# EAGLE design ESP32C-Mini-MQL-Injection-V2 (EAGLE 7.7.0)
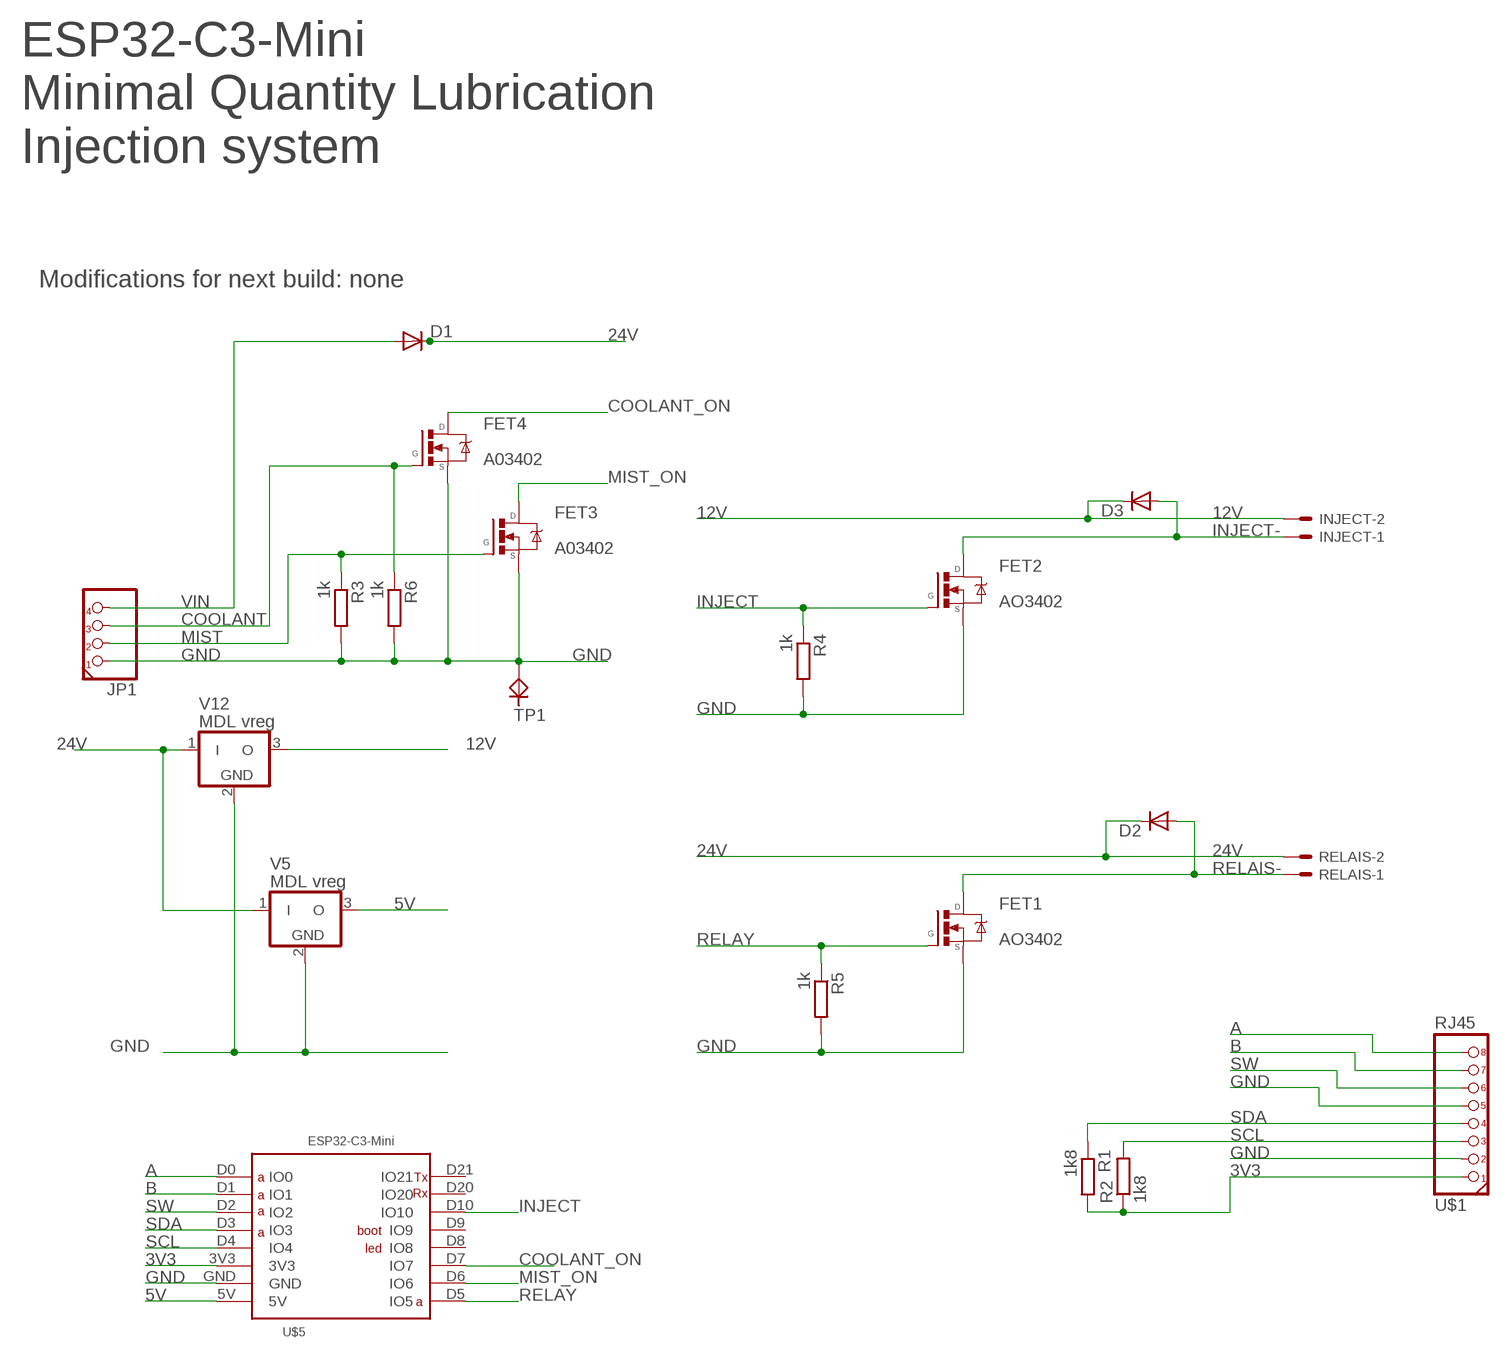
[diagram p0: schematic, sheet 1]

## Parts
D1  DIODE-DO214ACI  [DO214ACI]
D2  DIODE-DO214ACI  [DO214ACI]
D3  DIODE-DO214ACI  [DO214ACI]
FET1  AO3402  NFETHEX-S  [SOT23-FET]
FET2  AO3402  NFETHEX-S  [SOT23-FET]
FET3  A03402  NFETHEX-S  [SOT23-FET]
FET4  A03402  NFETHEX-S  [SOT23-FET]
INJECT  JST-XH-02-PIN-L  [JST-XH-02-L]
JP1  PINHD-1X4PH254  [1X04/PH254]
R1  1k8  R-EU_R0805  [R0805]
R2  1k8  R-EU_R0805  [R0805]
R3  1k  R-EU_R0805  [R0805]
R4  1k  R-EU_R0805  [R0805]
R5  1k  R-EU_R0805  [R0805]
R6  1k  R-EU_R0805  [R0805]
RELAIS  JST-XH-02-PIN-L  [JST-XH-02-L]
TP1  TESTPIN-TP10  [TP10]
U$1  RJ45  [RJ45]
U$5  ESP32C3MINIL  [ESP32-C3-MINI]
V5  MDL vreg  VREGMDLSTDWNV  [MDLSTEPDOWNV02]
V12  MDL vreg  VREGMDLSTDWNV  [MDLSTEPDOWNV02]

## Nets
3V3: R1.2 R2.1 U$1.P$1 U$5.3V3
5V: U$5.5V V5.3(O)
12V: D3.C INJECT.2 V12.3(O)
24V: D1.C D2.C RELAIS.2 V5.1(I) V12.1(I)
A: U$1.P$8 U$5.D0(IO0)
B: U$1.P$7 U$5.D1(IO1)
COOLANT: FET4.G JP1.3 R6.1
COOLANT_ON: FET4.D U$5.D7(IO7)
GND: FET1.S FET2.S FET3.S FET4.S JP1.1 R3.2 R4.2 R5.2 R6.2 TP1.TP U$1.P$2 U$1.P$5 U$5.GND V5.2(GND) V12.2(GND)
INJECT: FET2.G R4.1 U$5.D10(IO10)
INJECT-: D3.A FET2.D INJECT.1
MIST: FET3.G JP1.2 R3.1
MIST_ON: FET3.D U$5.D6(IO6)
RELAIS-: D2.A FET1.D RELAIS.1
RELAY: FET1.G R5.1 U$5.D5(IO5)
SCL: R2.2 U$1.P$3 U$5.D4(IO4)
SDA: R1.1 U$1.P$4 U$5.D3(IO3)
SW: U$1.P$6 U$5.D2(IO2)
VIN: D1.A JP1.4
Unconnected: U$5.D8(IO8) U$5.D9(IO9) U$5.D20(IO20) U$5.D21(IO21)

## Notes on the sheet
- ESP32-C3-Mini
  Minimal Quantity Lubrication
  Injection system
- Modifications for next build: none

## Library data of the parts
D1-D3 = MyLib:DIODE: DIODE Diode
FET1-FET4 = MyLib:NFETHEX
INJECT RELAIS = JST-XH-Pins-Swapped:JST-XH-02-PIN: JST XH Connector 2 Pin Wire to board connector. Pitch: 2,54 mm, (0.100") Number of pins: 2 Created by Rembrandt Electronics www.rembrandtelectronics.com
JP1 = MyLib:PINHD-1X4: PIN HEADER
R1-R6 = rcl:R-EU_: RESISTOR, European symbol
TP1 = MyLib:TESTPIN
U$1 = MyLib:RJ45
U$5 = ESP32:ESP32C3MINI
V5 V12 = MyLib:VREG: 3 terminal voltage regulator PIN-1 input PIN-2 GND PIN-3 Output 78XX,79XX,LP2950

## Net classes
0 default: width 0.254 mm, clearance 0.254 mm
3 usbvcc: width 0.508 mm, drill 0.61 mm, clearance 0.254 mm

## Board
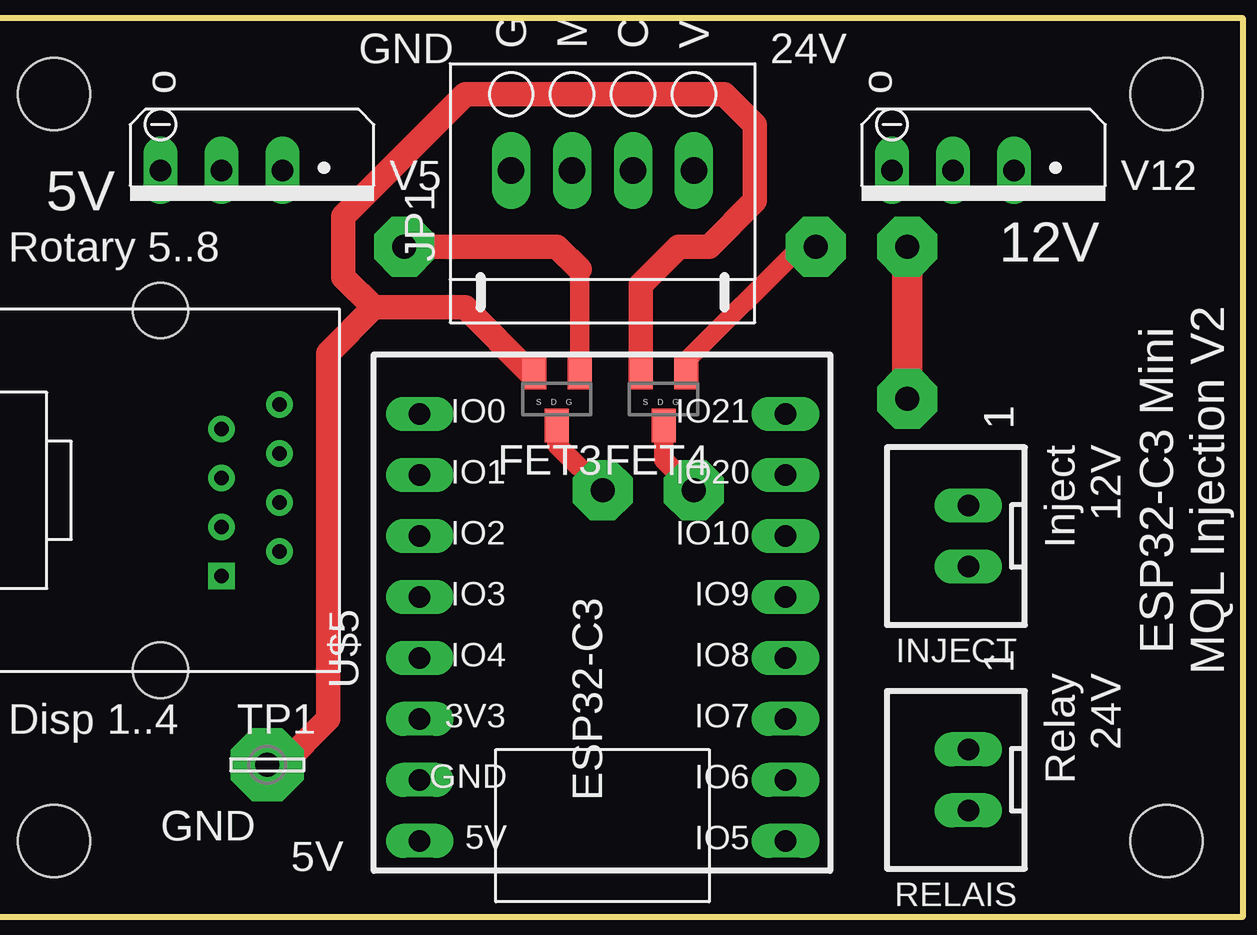
[diagram p1: board, top side]
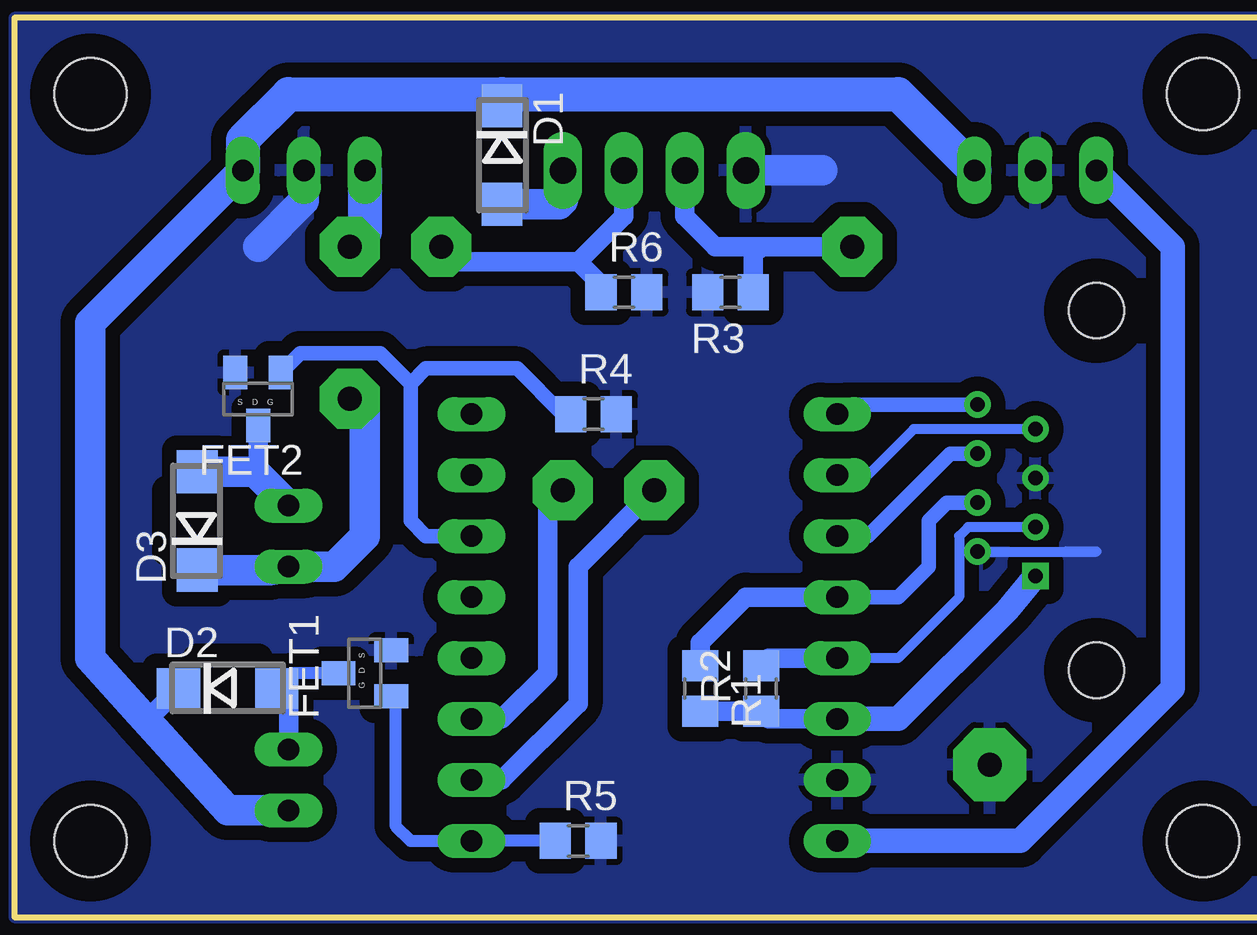
[diagram p2: board, bottom side, seen from below]

No outline drawn. Coordinates in mm, seen from the top.
Copper layers (1*16): Top 0.035mm / dielectric 1.5mm / Bottom 0.035mm
Design rules "default *": minimum track width 10mil, minimum drill 0.6mm, track to track 0.2mm, track to pad 0.2mm, pad to pad 0.2mm, via to via 0.2mm, smd to smd 0.2mm, copper to edge 40mil, drill to drill 8mil, minimum pad ring 10mil, minimum via ring 8mil, stop-mask expansion 4mil, vias tented up to drill 0mil, thermal gap 10mil
Holes 3 mm at 49.53,34.29 49.53,3.17 3.17,34.29 3.17,3.17
Milling: 4 lines

### Footprints (pad centres in the part's own frame; a part is rotated, then mirrored left to right if it is on the bottom)
DO214ACI = smd 1.8 x 1.7: A 2.05,0; C -2.05,0
SOT23-FET = smd 1 x 1.4: D 0,1.1; G -0.95,-1.1; S 0.95,-1.1
JST-XH-02-L = drill 0.9 long: 1 1.27,0; 2 -1.27,0
1X04/PH254 = drill 1.1 long: 1 -3.81,0; 2 -1.27,0; 3 1.27,0; 4 3.81,0
R0805 = smd 1.3 x 1.5: 1 -0.95,0; 2 0.95,0
TP10 = drill 1 pad 3.048 octagon: TP 0,0
RJ45 = drill 0.6 square: P$1 1.905,3.57 | drill 0.6: P$2 -0.508,2.55; P$3 1.905,1.53; P$4 -0.508,0.51; P$5 1.905,-0.51; P$6 -0.508,-1.53; P$7 1.905,-2.55; P$8 -0.508,-3.57 | hole 2.3: 4.445,7.493; 4.445,-7.493
ESP32-C3-MINI = drill 0.9 long: 3V3 -5.08,8.89; 5V -10.16,8.89; D0 7.62,8.89; D1 5.08,8.89; D2 2.54,8.89; D3 0,8.89; D4 -2.54,8.89; D5 -10.16,-6.35; D6 -7.62,-6.35; D7 -5.08,-6.35; D8 -2.54,-6.35; D9 0,-6.35; D10 2.54,-6.35; D20 5.08,-6.35; D21 7.62,-6.35; GND -7.62,8.89
MDLSTEPDOWNV02 = drill 0.9 long: 1 -2.54,-2.54; 2 0,-2.54; 3 2.54,-2.54

### Placement (x,y rotation side)
D1  32.38,31.75 270 bottom
D2  43.81,9.53 0 bottom
D3  45.09,16.51 90 bottom
FET1  38.1,10.16 90 bottom
FET2  42.55,21.59 180 bottom
FET3  24.13,21.59 180 top
FET4  28.57,21.59 180 top
INJECT  41.27,15.88 90 top
JP1  26.04,31.11 0 top
R1  24.13,9.53 270 bottom
R2  21.59,9.53 90 bottom
R3  22.86,26.04 180 bottom
R4  28.57,20.95 0 bottom
R5  29.21,3.17 0 bottom
R6  27.3,26.04 0 bottom
RELAIS  41.27,5.71 90 top
TP1  12.06,6.35 0 top
U$1  12.06,17.78 180 top
U$5  27.3,13.34 90 top
V5  10.16,28.57 180 top
V12  40.64,28.57 180 top

### Tracks (layer width: path | path; a pad name or v marks a point on that pad's centre or on a via)
3V3
  Bottom 0.813: R1.2 R2.1 21.27,8.26 U$5.3V3
  Bottom 1.016: U$1.P$1 11.34,12.79 15.88,8.26 U$5.3V3
5V
  Bottom 1.016: U$5.5V 10.79,3.17 4.45,9.53 4.45,27.94 V5.3
12V  (via drill 1 pad 2.5)
  Top 1.27: v38.73,21.59 v38.73,27.94
  Bottom 1.27: D3.C 42.05,14.46 INJECT.2 39.37,14.61 38.1,15.88 38.1,20.95 v38.73,21.59
  Bottom 1.422: V12.3 38.1,28.57 v38.73,27.94
24V
  Bottom 0.813: D2.C 46.91,8.48 47.45,8.48
  Bottom 1.27: V12.1 49.53,24.77 49.53,10.79 47.45,8.48 43.81,4.45 RELAIS.2 | D1.C 32.38,34.29
  Bottom 1.422: V5.1 15.88,34.29 32.38,34.29 41.27,34.29 43.18,32.38 V12.1
A
  Bottom 0.61: U$1.P$8 18.02,21.35 U$5.D0
B
  Bottom 0.406: U$1.P$7 15.23,20.33 17.14,18.41 U$5.D1
COOLANT  (via drill 1 pad 2.5)
  Top 0.813: FET4.G 29.52,23.18 34.29,27.94 v34.92,27.94
  Bottom 0.813: JP1.3 27.3,29.21 29.21,27.3 | R6.1 28.25,26.35 29.21,27.3 | 29.21,27.3 34.29,27.3 v34.92,27.94
COOLANT_ON  (via drill 1 pad 2.5)
  Top 0.813: FET4.D 28.57,19.05 v29.84,17.78
  Bottom 0.813: v29.84,17.78 30.48,17.78 30.48,10.16 32.38,8.26 U$5.D7
GND
  Top 1.016: 16.51,25.4 15.24,26.67 15.24,29.21 20.32,34.29 31.11,34.29 32.38,33.02 32.38,29.84 30.48,27.94 29.21,27.94 27.62,26.36 FET4.S | TP1.TP 12.7,6.35 14.61,8.26 14.61,23.5 16.51,25.4 | FET3.S 23.03,22.69 20.32,25.4 16.51,25.4
  Bottom 0.406: U$1.P$2 7.62,15.23 8.89,15.24
  Bottom 1.27: V12.2 40.64,29.84 42.55,27.94 | JP1.1 19.05,31.11
  pour Bottom (isolate 0.61): 0,0 0,37.47 52.7,37.47 52.7,0
INJECT
  Bottom 0.61: 36.2,22.23 37.47,23.5 40.79,23.5 FET2.G | 36.2,22.23 36.2,16.51 35.56,15.88 U$5.D10 | 36.2,22.23 35.56,22.86 31.75,22.86 29.84,20.95 R4.1
INJECT-
  Bottom 0.813: FET2.D 42.55,18.7 42.69,18.56
  Bottom 1.27: INJECT.1 42.69,18.56 D3.A
MIST  (via drill 1 pad 2.5)
  Top 0.813: FET3.G 25.08,26.99
  Top 1.016: 25.08,26.99 24.13,27.94 v17.78,27.94
  Bottom 0.813: JP1.2 24.77,29.21 23.5,27.94 21.59,27.94 | 21.59,27.94 v17.78,27.94 | R3.1 21.91,27.62 21.59,27.94
MIST_ON  (via drill 1 pad 2.5)
  Top 0.813: FET3.D 24.13,19.68 v26.04,17.78
  Bottom 0.813: U$5.D6 32.38,5.71 29.21,8.89 29.21,14.61 v26.04,17.78
RELAIS-
  Bottom 0.508: FET1.D 41.13,10.16 D2.A
  Bottom 0.813: D2.A 41.27,9.04 RELAIS.1
RELAY
  Bottom 0.508: FET1.G 36.83,9.21 36.83,3.81 36.2,3.17 U$5.D5 R5.1
SCL
  Bottom 0.406: 17.78,10.79 U$5.D4 15.88,10.79 13.34,13.34 13.34,15.88 12.96,16.25 U$1.P$3
  Bottom 0.813: R2.2 21.27,10.79 U$5.D4
SDA
  Bottom 0.61: U$1.P$4 13.85,17.27 14.61,16.51 14.61,14.61 15.88,13.34 U$5.D3
  Bottom 0.813: R1.1 24.13,11.43 22.23,13.34 U$5.D3
SW
  Bottom 0.61: U$1.P$6 13.71,19.31 17.14,15.88 U$5.D2
VIN
  Bottom 1.27: D1.A 29.99,29.7 29.84,29.84 JP1.4

### Text on the board
_tsilk: GND | G | M | C | V | 24V | o | o | 5V | Rotary 5..8 | 12V | 1 | Inject / 12V | ESP32-C3 Mini / MQL Injection V2 | ESP32-C3 | 1 | Relay / 24V | Disp 1..4 | GND | 5V